# Altium project Common_Sensor_Box.PrjPCB (part 17 of 17)

## Sheet Sensor_Box_RTD2DIG.SchDoc: Title
size 420 x 297 mm; Author: G.Kasprowicz; CompanyName: WUT ISE; DrawnBy: G.Kasprowicz; Organization: WUT ISE; Address1: PW ISE; Address2: Nowowiejska 15/19 00-665 Warsaw; Address3: gkasprow@gmail.com; Revision: 1.0; SheetNumber: -; SheetTotal: -; ModifiedBy: -; CheckedDate: -; Title2: Title2; DivGrp: WUT ISE; Designer: G.Kasprowicz; ModifiedDate: -; ProjectName: Sensor Box
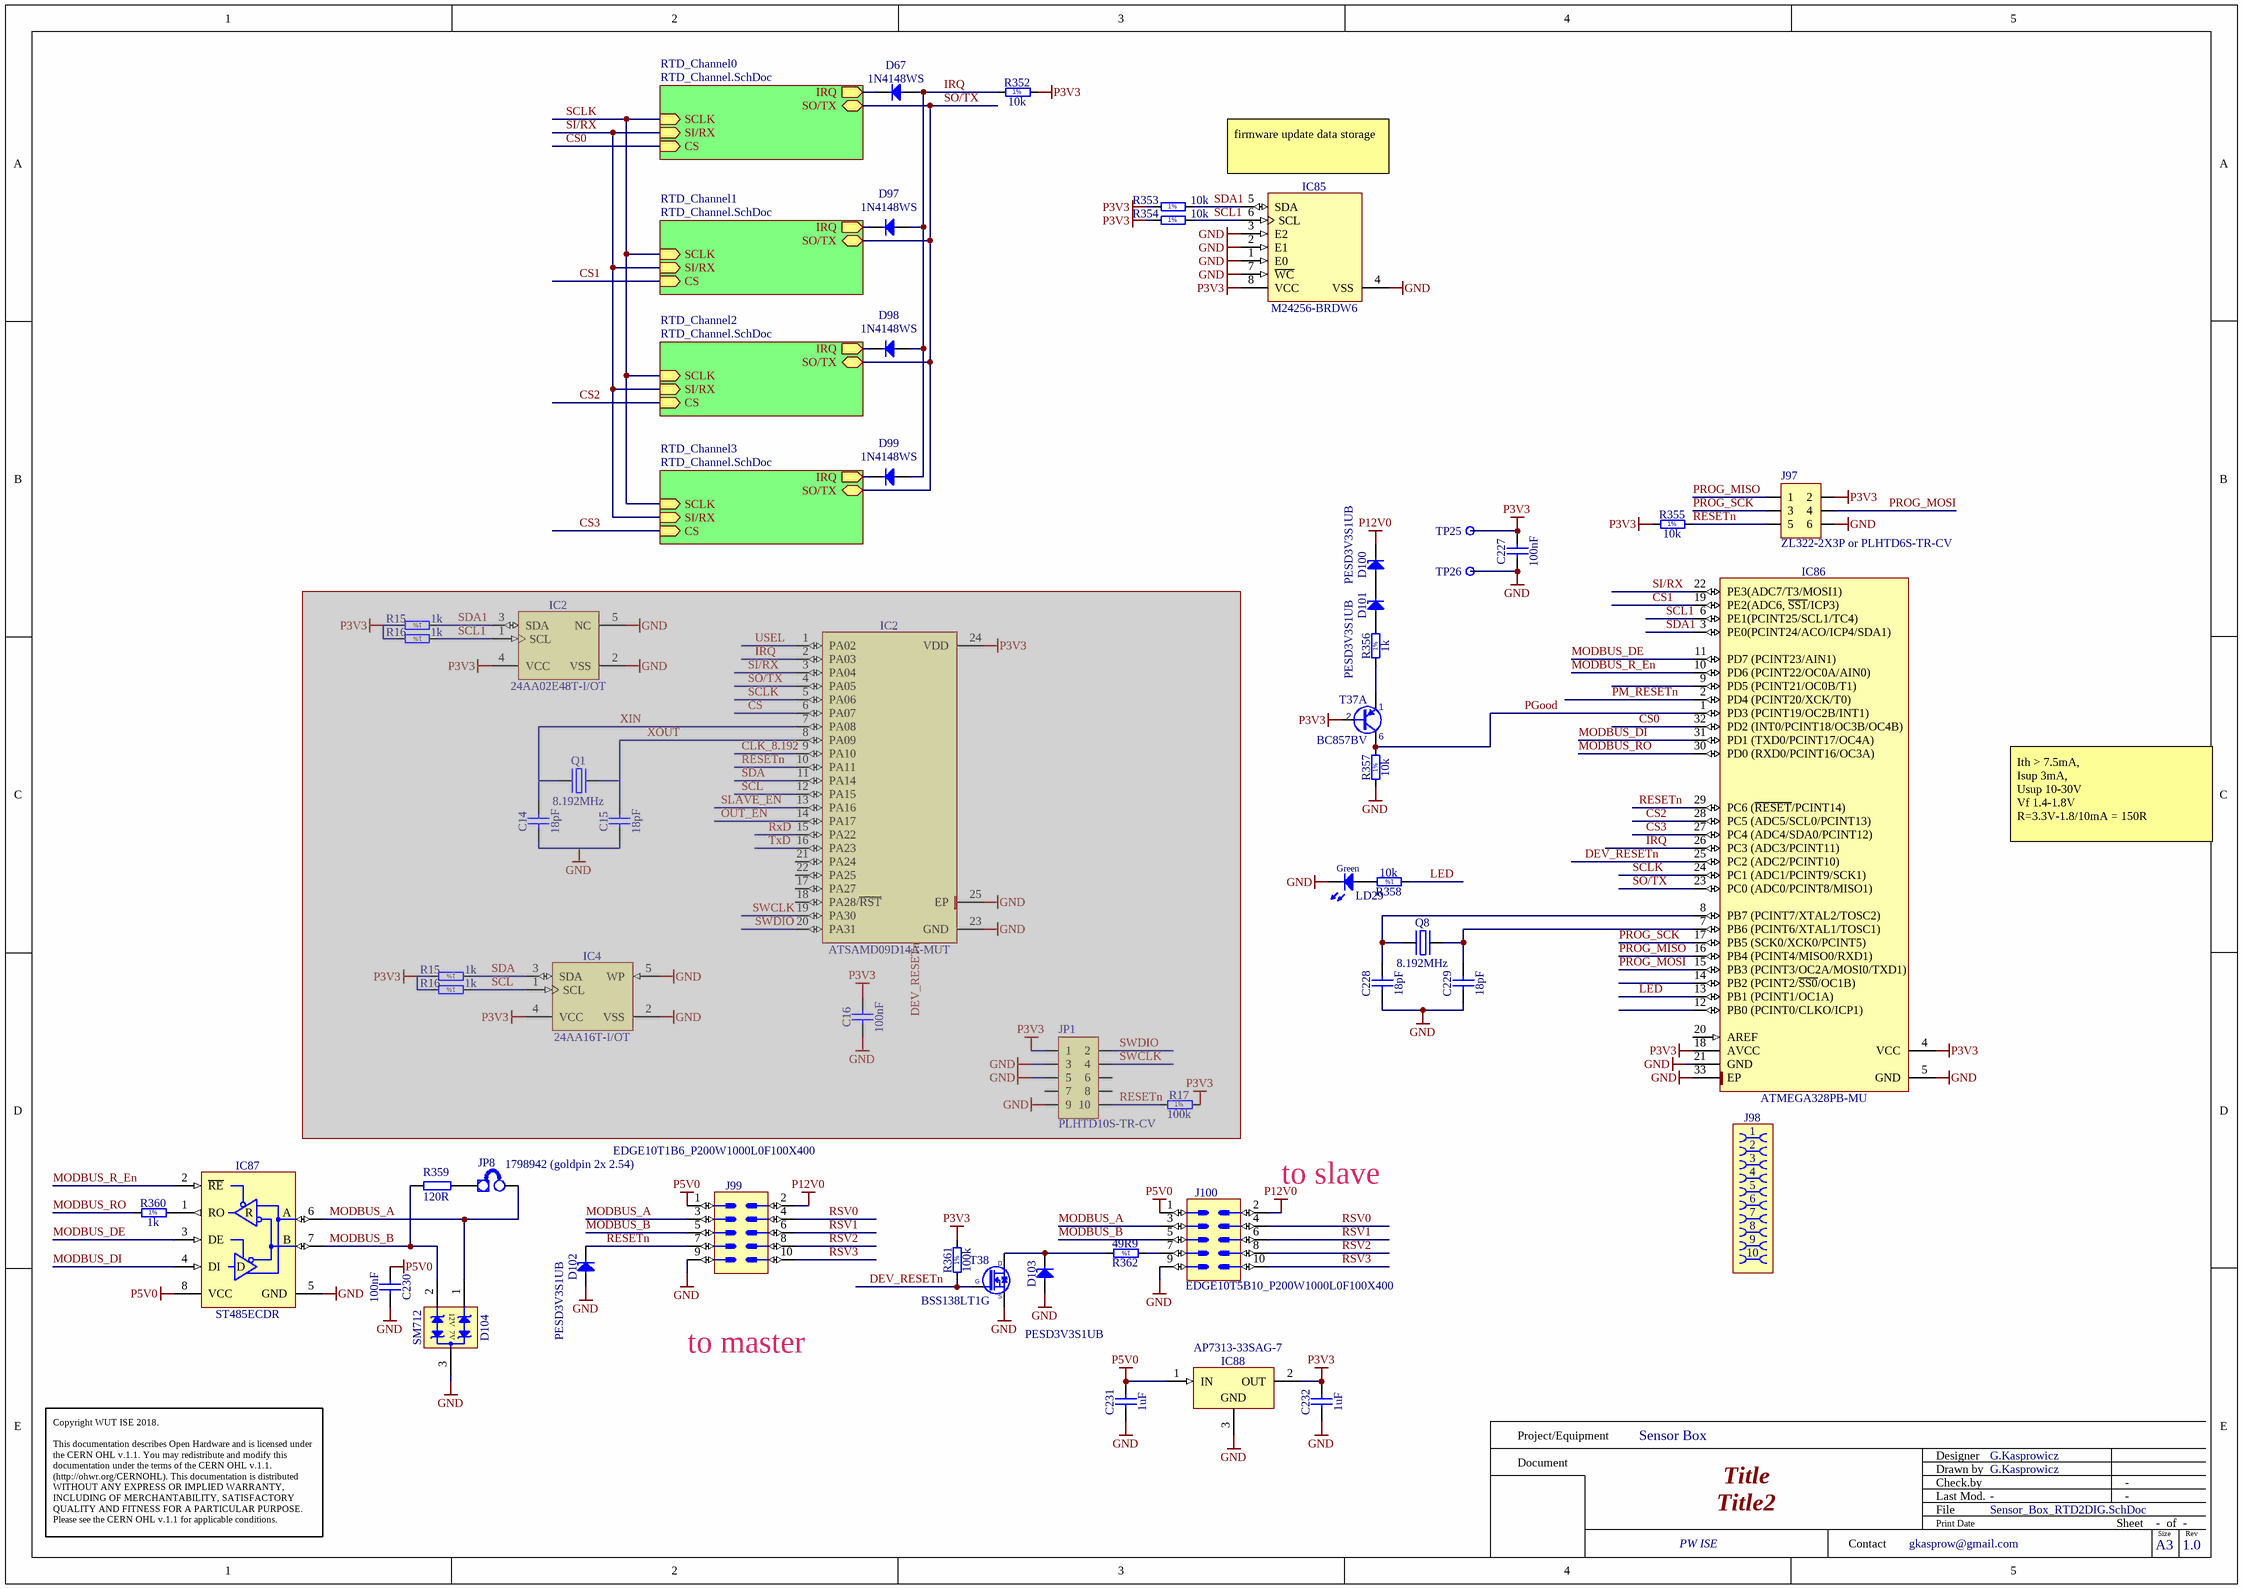
[diagram p24: Sensor_Box_RTD2DIG.SchDoc]

### Parts
(Parts that share a designator on the sheet are numbered #1, #2 ... from top to bottom, then left to right.)
C14#4  18pF  [CAPC1005X55N]  (masked out: inside a compile mask, not in the netlist)
C15#4  18pF  [CAPC1005X55N]  (masked out: inside a compile mask, not in the netlist)
C16#4  100nF  [CAPC1005X55N]  (masked out: inside a compile mask, not in the netlist)
C227  100nF  [CAPC1005X55N]
C228  18pF  [CAPC1005X55N]
C229  18pF  [CAPC1005X55N]
C230  100nF  [CAPC1005X55N]
C231  1uF  [CAPC1005X55N]
C232  1uF  [CAPC1005X55N]
D67  1N4148WS  [SODFL2512X100N]
D97  1N4148WS  [SODFL2512X100N]
D98  1N4148WS  [SODFL2512X100N]
D99  1N4148WS  [SODFL2512X100N]
D100  PESD3V3S1UB  [SODFL1608X65N]
D101  PESD3V3S1UB  [SODFL1608X65N]
D102  PESD3V3S1UB  [SODFL1608X65N]
D103  PESD3V3S1UB  [SODFL1608X65N]
D104  SM712  [SOT95P237X112-3N]
IC2#6  24AA02E48T-I/OT  [SOT95P280X145-5N]  (masked out: inside a compile mask, not in the netlist)
IC2#7  ATSAMD09D14A-MUT  [QFN50P400X400X90-25N-S275]  (masked out: inside a compile mask, not in the netlist)
IC4#4  24AA16T-I/OT  [SOT95P280X145-5N]  (masked out: inside a compile mask, not in the netlist)
IC85  M24256-BRDW6  [SOP65P640X120-8N]
IC86  ATMEGA328PB-MU  [QFN50P500X500X100-33N-S325]
IC87  ST485ECDR  [SOIC127P600X175-8N]
IC88  AP7313-33SAG-7  [SOT95P240X130-3N]
J97  ZL322-2X3P or PLHTD6S-TR-CV  [ZL322-2X3P]
J98  (no value)  [AVX_00 9159 010 061 916]
J99  (no value)  [EDGE10T1B6_P200W1000L0F100X400]
J100  (no value)  [EDGE10T5B10_P200W1000L0F100X400]
JP1#4  PLHTD10S-TR-CV  [PLHTD10S-TR-CV]  (masked out: inside a compile mask, not in the netlist)
JP8#2  1798942 (goldpin 2x 2.54)  [jump]
LD29  Green  [LED_KINGBRIGHT_KPH-1608CGCK]
Q1#4  8.192MHz  [XTAL_ABRACON_ABLS]  (masked out: inside a compile mask, not in the netlist)
Q8  8.192MHz  [XTAL_ABRACON_ABLS]
R15#6  1k  [RESC1005X40N]  (masked out: inside a compile mask, not in the netlist)
R15#7  1k  [RESC1005X40N]  (masked out: inside a compile mask, not in the netlist)
R16#6  1k  [RESC1005X40N]  (masked out: inside a compile mask, not in the netlist)
R16#7  1k  [RESC1005X40N]  (masked out: inside a compile mask, not in the netlist)
R17#4  100k  [RESC1005X40N]  (masked out: inside a compile mask, not in the netlist)
R352  10k  [RESC1005X40N]
R353  10k  [RESC1005X40N]
R354  10k  [RESC1005X40N]
R355  10k  [RESC1005X40N]
R356  1k  [RESC1005X40N]
R357  10k  [RESC1005X40N]
R358  10k  [RESC1005X40N]
R359  120R  [1206R]
R360  1k  [RESC1005X40N]
R361  100k  [RESC1005X40N]
R362  49R9  [RESC1005X40N]
T37  BC857BV  [SOTFL50P160X60-6N]  (part A of 2)
T38  BSS138LT1G  [SOT95P240X110-3N]
TP25  Test Point  [TPS127]  (value not drawn)
TP26  Test Point  [TPS127]  (value not drawn)

### Sub-sheets
RTD_Channel0 = RTD_Channel.SchDoc: IRQ (out), SCLK (in), SI/RX (in), CS (in), SO/TX (bidir)
RTD_Channel1 = RTD_Channel.SchDoc: IRQ (out), SCLK (in), SI/RX (in), CS (in), SO/TX (bidir)
RTD_Channel2 = RTD_Channel.SchDoc: IRQ (out), SCLK (in), SI/RX (in), CS (in), SO/TX (bidir)
RTD_Channel3 = RTD_Channel.SchDoc: IRQ (out), SCLK (in), SI/RX (in), CS (in), SO/TX (bidir)

### Nets
GND: C227.1 C228.1 C229.1 C230.2 C231.1 C232.1 D102.2(A) D103.2(A) D104.3(GND) IC85.1(E0) IC85.2(E1) IC85.3(E2) IC85.4(VSS) IC85.7(~{WC}) IC86.5(GND) IC86.21(GND) IC86.33(EP) IC87.5(GND) IC88.3(GND) J97.6 J99.9 J100.9 LD29.1(C) R357.1 T38.2(S) TP26.1
P3V3: C227.2 C232.2 IC85.8(VCC) IC86.4(VCC) IC86.18(AVCC) IC88.2(OUT) J97.2 R352.2 R353.1 R354.1 R355.1 R361.2 T37.2(B) TP25.1
P5V0: C230.1 C231.2 IC87.8(VCC) IC88.1(IN) J99.1 J100.1
P12V0: D100.1(C) J99.2 J100.2
CS0: IC86.32(PD2_(INT0/PCINT18/OC3B/OC4B)) ; sheet RTD_Channel0/CS
CS1: IC86.19(PE2(ADC6,_~{SS1}/ICP3)) ; sheet RTD_Channel1/CS
CS2: IC86.28(PC5_(ADC5/SCL0/PCINT13)) ; sheet RTD_Channel2/CS
CS3: IC86.27(PC4_(ADC4/SDA0/PCINT12)) ; sheet RTD_Channel3/CS
DEV_RESETn: IC86.25(PC2_(ADC2/PCINT10)) R361.1 T38.1(G)
IRQ: D67.2(A) D97.2(A) D98.2(A) D99.2(A) IC86.26(PC3_(ADC3/PCINT11)) R352.1
LED: IC86.13(PB1_(PCINT1/OC1A)) R358.1
MODBUS_A: D104.1(I/O1) IC87.6(A) J99.3 J100.3 JP8#2.2(E2)
MODBUS_B: D104.2(I/O2) IC87.7(B) J99.5 J100.5 R359.1
MODBUS_DE: IC86.11(PD7_(PCINT23/AIN1)) IC87.3(DE)
MODBUS_DI: IC86.31(PD1_(TXD0/PCINT17/OC4A)) IC87.4(DI)
MODBUS_R_En: IC86.10(PD6_(PCINT22/OC0A/AIN0)) IC87.2(~{RE})
MODBUS_RO: IC86.30(PD0_(RXD0/PCINT16/OC3A)) R360.1
PGood: IC86.1(PD3_(PCINT19/OC2B/INT1)) R357.2 T37.6(C)
PM_RESETn: IC86.2(PD4_(PCINT20/XCK/T0))
PROG_MISO: IC86.16(PB4_(PCINT4/MISO0/RXD1)) J97.1
PROG_MOSI: IC86.15(PB3_(PCINT3/OC2A/MOSI0/TXD1)) J97.4
PROG_SCK: IC86.17(PB5_(SCK0/XCK0/PCINT5)) J97.3
RESETn: D102.1(C) IC86.29(PC6_(~{RESET}/PCINT14)) J97.5 J99.7 R355.2
RSV0: J99.4 J100.4
RSV1: J99.6 J100.6
RSV2: J99.8 J100.8
RSV3: J99.10 J100.10
SCL1: IC85.6(SCL) IC86.6(PE1(PCINT25/SCL1/TC4)) R354.2
SCLK: IC86.24(PC1_(ADC1/PCINT9/SCK1)) ; sheet RTD_Channel0/SCLK, sheet RTD_Channel1/SCLK, sheet RTD_Channel2/SCLK, sheet RTD_Channel3/SCLK
SDA1: IC85.5(SDA) IC86.3(PE0(PCINT24/ACO/ICP4/SDA1)) R353.2
SI/RX: IC86.22(PE3(ADC7/T3/MOSI1)) ; sheet RTD_Channel0/SI/RX, sheet RTD_Channel1/SI/RX, sheet RTD_Channel2/SI/RX, sheet RTD_Channel3/SI/RX
SO/TX: IC86.23(PC0_(ADC0/PCINT8/MISO1)) ; sheet RTD_Channel0/SO/TX, sheet RTD_Channel1/SO/TX, sheet RTD_Channel2/SO/TX, sheet RTD_Channel3/SO/TX
NetC228_2: C228.2 IC86.8(PB7_(PCINT7/XTAL2/TOSC2)) Q8.1(OSC1)
NetC229_2: C229.2 IC86.7(PB6_(PCINT6/XTAL1/TOSC1)) Q8.2(OSC2)
NetD67_1: D67.1(C) ; sheet RTD_Channel0/IRQ
NetD97_1: D97.1(C) ; sheet RTD_Channel1/IRQ
NetD98_1: D98.1(C) ; sheet RTD_Channel2/IRQ
NetD99_1: D99.1(C) ; sheet RTD_Channel3/IRQ
NetD100_2: D100.2(A) D101.1(C)
NetD101_2: D101.2(A) R356.2
NetD103_1: D103.1(C) R362.2 T38.3(D)
NetIC87_1: IC87.1(RO) R360.2
NetJ100_7: J100.7 R362.1
NetJP8#2_1: JP8#2.1(E1) R359.2
NetLD29_2: LD29.2(A) R358.2
NetR356_1: R356.1 T37.1(E)

Not connected (* = marked no-connect by the designer): IC86 9(PD5_(PCINT21/OC0B/T1)) 12(PB0_(PCINT0/CLKO/ICP1)) 14(PB2_(PCINT2/~{SS0}/OC1B)) 20(AREF)

### Notes on the sheet
- firmware update data storage
- Ith > 7.5mA,
  Isup 3mA,
  Usup 10-30V
  Vf 1.4-1.8V
  R=3.3V-1.8/10mA = 150R
- (near J100) to slave
- to master
- Project/Equipment
- Document
- Designer
- Drawn by
- Check.by
- Copyright WUT ISE 2018.
  This documentation describes Open Hardware and is licensed under the CERN OHL v.1.1. You may redistribute and modify this documentation under the terms of the CERN OHL v.1.1. (http://ohwr.org/CERNOHL). This documentation is distributed WITHOUT ANY EXPRESS OR IMPLIED WARRANTY, INCLUDING OF MERCHANTABILITY, SATISFACTORY QUALITY AND FITNESS FOR A PARTICULAR PURPOSE. Please see the CERN OHL v.1.1 for applicable conditions.
- Contact
- File
- Last Mod.
- Print Date
- Sheet
- Size
- A3
- of
- Rev
- (in symbol R0402_1K_1%_0.0625W_100PPM) 1%
- (in symbol R0402_10K_1%_0.0625W_100PPM) 1%
- (in symbol R0402_49R9_1%_0.0625W_100PPM) 1%
- (in symbol R0402_100K_1%_0.0625W_100PPM) 1%
- (in symbol SM712) 12V; 7V
- (in symbol ST485ECDR) R; D

### Library data of the parts
C14#4 C15#4 C228 C229 = CC0402_18PF_50V_5%_C0G: as C14#3 on sheet Sensor_Box_Water_Meter_Valve; Part Number: CC0402_18PF_50V_5%_C0G; Component Kind: Standard; Component Type: Standard; Pin Count: 2; Value: 18pF; Status: Preferred; Manufacturer Part Number: CC0402_18PF_50V_5%_C0G; Case: 0402; Mounted: Yes; Socket: No; SMD: Yes; Sense: No; Manufacturer1 Example: KEMET; Manufacturer1 ComponentHeight: 0.55mm; HelpURL: \\cern.ch\dfs\Applications\Altium\Datasheets\CC0805_C0G_KEMET_(Commercial Grade).pdf; Author: CERN DEM JLC; CreateDate: 04.10.2016; LatestRevisionDate: 04.10.2016
C16#4 C227 = CC0402_100NF_16V_10%_X5R: as C16#3 on sheet Sensor_Box_Water_Meter_Valve; Part Number: CC0402_100NF_16V_10%_X5R; Component Kind: Standard; Component Type: Standard; Pin Count: 2; Value: 100nF; Status: None; Manufacturer Part Number: CC0402_100NF_16V_10%_X5R; Case: 0402; Mounted: Yes; Socket: No; SMD: Yes; Sense: No; Manufacturer1 Example: MURATA; Manufacturer1 ComponentHeight: 0.55mm; HelpURL: \\cern.ch\dfs\Applications\Altium\Datasheets\CC0402_X5R_MURATA_GRM.pdf; Author: CERN DEM JLC; CreateDate: 10.12.2013; LatestRevisionDate: 10.12.2013
C230 = CC0402_100NF_16V_10%_X7R: as C315 on sheet Sensor_Box_Water_Meter_Valve; Part Number: CC0402_100NF_16V_10%_X7R; Component Kind: Standard; Component Type: Standard; Pin Count: 2; Value: 100nF; Status: Not Recommended; Manufacturer Part Number: CC0402_100NF_16V_10%_X7R; Case: 0402; Mounted: Yes; Socket: No; SMD: Yes; Manufacturer1 Example: MURATA; Manufacturer1 ComponentHeight: 0.55mm; HelpURL: \\cern.ch\dfs\Applications\Altium\Datasheets\CC0402_X7R_MURATA_GRM.pdf; Author: CERN DEM JLC; CreateDate: 05.12.2013; LatestRevisionDate: 03.12.2007; Sense: No
C231 C232 = CC0402_1UF_16V_10%_X5R: as C308 on sheet Sensor_Box_Water_Meter_Valve; Part Number: CC0402_1UF_16V_10%_X5R; Component Kind: Standard; Component Type: Standard; Pin Count: 2; Value: 1uF; Status: Preferred; Manufacturer Part Number: CC0402_1UF_16V_10%_X5R; Case: 0402; Mounted: Yes; Socket: No; SMD: Yes; Sense: No; Manufacturer1 Example: TDK; Manufacturer1 ComponentHeight: 0.55mm; HelpURL: \\cern.ch\dfs\Applications\Altium\Datasheets\CC0402_X5R_TDK_C.pdf; Author: CERN DEM JLC; CreateDate: 25.10.2012; LatestRevisionDate: 25.10.2012
D67 D97-D99 = 1N4148WS: as D126 on sheet Sensor_Box_Water_Meter_Valve; Part Number: 1N4148WS; Component Kind: Standard; Component Type: Standard; Device: 1N4148WS; PackageDescription: SODFL Diode; 1.70mm W X 1.25mm L X 1.00mm H body, IPC Medium Density; Manufacturer Part Number: 1N4148WS; Pin Count: 2; Case: SOD-323F; Mounted: Yes; Socket: No; SMD: Yes; Sense: No; ComponentHeight: 1mm; HelpURL: \\cern.ch\dfs\Applications\Altium\Datasheets\1N4148WS.pdf; Author: CERN DEM JLC; CreateDate: 12.05.2011; LatestRevisionDate: 12.05.2011
D100-D103 = PESD3V3S1UB: as D129-D131 on sheet Sensor_Box_Water_Meter_Valve; Part Number: PESD3V3S1UB; Component Kind: Standard; Component Type: Standard; Device: PESD3V3S1UB; PackageDescription: Ultra Small Outline Diode Flat Lead (SOD-523), Body; 1.2mm L X 0.8mm W X 0.65mm H, IPC Medium Density; Manufacturer Part Number: PESD3V3S1UB; Pin Count: 2; Case: SOD523; Mounted: Yes; Socket: No; SMD: Yes; Sense: No; ComponentHeight: 0.65mm; HelpURL: \\cern.ch\dfs\Applications\Altium\Datasheets\PESD3V3S1UB.pdf; Author: CERN DEM JLC; CreateDate: 29.11.2012; LatestRevisionDate: 29.11.2012
D104 = SM712: as D132 on sheet Sensor_Box_Water_Meter_Valve; Part Number: SM712; Component Kind: Standard; Component Type: Standard; Device: SM712; PackageDescription: SOT, 0.95mm, pitch; 3 pin,1.30mm W X 2.92mm L X 1.12mm H body, IPC Medium Density; Status: Obsolete; Part Description: Asymmetrical TVS Diode for Extended Common-Mode RS-485; Manufacturer Part Number: SM712; Pin Count: 3; Case: SOT-23; Mounted: Yes; Socket: No; SMD: Yes; Sense: No; ComponentHeight: 1.12mm; HelpURL: \\cern.ch\dfs\Applications\Altium\Datasheets\SM712.pdf; Author: CERN DEM JLC; CreateDate: 23.04.2012; LatestRevisionDate: 23.04.2012
IC2#6 = 24AA02E48T-I/OT: as IC2#4 on sheet Sensor_Box_Water_Meter_Valve; Part Number: 24AA02E48T-I/OT; Component Kind: Standard; Component Type: Standard; Device: 24AA02E48T-I/OT; PackageDescription: SOT, 0.95mm pitch; 5 pin, 1.60mm W X 2.90mm L X 1.45mm H body, IPC Medium Density; Part Description: 1.7V-5.5V, 2K I2C Serial EEPROM With EUI-48 Node Identity; Manufacturer Part Number: 24AA02E48T-I/OT; Pin Count: 5; Case: SOT23-5; Mounted: Yes; Socket: No; SMD: Yes; Sense: No; ComponentHeight: 1.45mm; HelpURL: \\cern.ch\dfs\Applications\Altium\Datasheets\24AA02E48T-I-OT.pdf; Author: CERN DEM MR; CreateDate: 31.03.2016; LatestRevisionDate: 31.03.2016
IC2#7 = ATSAMD09D14A-MUT: as IC2#5 on sheet Sensor_Box_Water_Meter_Valve; Part Number: ATSAMD09D14A-MUT; Component Kind: Standard; Component Type: Standard; Device: ATSAMD09D14A-MUT; PackageDescription: QFN, 0.50mm Pitch, Square; 24 Pin, 4.00mm L X 4.00mm W X 0.90mm H Body (w/Thermal Tab 2.75 X 2.75 mm), IPC Medium Density; Part Description: 32-bit ARM®-based Cortex®-M0+ core Microcontroller, 2.4V to 3.63V, 48MHz, 16KB Flash, 4 KB SRAM, 24 QFN, Temperature Range -40°C to 85°C; Manufacturer Part Number: ATSAMD09D14A-MUT; Pin Count: 25; Case: QFN24; Mounted: Yes; Socket: No; SMD: Yes; Sense: No; ComponentHeight: 0.9mm; HelpURL: \\cern.ch\dfs\Applications\Altium\Datasheets\ATSAMD09D14A-MUT.pdf; Author: CERN DEM MR; CreateDate: 13.02.2018; LatestRevisionDate: 13.02.2018
IC4#4 = MEM_24AA16T_SOT23: as IC4#3 on sheet Sensor_Box_Water_Meter_Valve; Part Number: 24AA16T-I/OT; Component Kind: Standard; Component Type: Standard; Device: 24AA16T-I/OT; PackageDescription: SOT, 0.95mm pitch; 5 pin, 1.60mm W X 2.90mm L X 1.45mm H body, IPC Medium Density; Manufacturer Part Number: 24AA16T-I/OT; Pin Count: 5; Case: SOT23-5; Mounted: Yes; Socket: No; SMD: Yes; Sense: No; ComponentHeight: 1.45mm; HelpURL: \\cern.ch\dfs\Applications\Altium\Datasheets\24AA02E48T-I-OT.pdf; Author: GK; CreateDate: 31.03.2016; LatestRevisionDate: 31.03.2016
IC85 = MEM_M24256-BRDW6P: as IC27 on sheet Sensor_Box_Water_Meter_Valve; Part Number: M24256-BRDW6P; Component Kind: Standard; Component Type: Standard; Device: M24256-BRDW6; PackageDescription: SOP, 0.65mm pitch; 8 pin, 4.40mm W X 3.00mm L X 1.20mm H body, IPC Medium Density; Part Description: 256-Kbit Serial I²C Bus EEPROM; Manufacturer Part Number: M24256-BRDW6; Pin Count: 8; Case: TSSOP8; Mounted: Yes; Socket: No; SMD: Yes; Sense: No; ComponentHeight: 1.2mm; HelpURL: \\cern.ch\dfs\Applications\Altium\Datasheets\M24256-BRDW6P.pdf; Author: CERN DEM MR; CreateDate: 17.03.2016; LatestRevisionDate: 17.03.2016
IC86 = UPC_ATMEGA328PB-MU: as IC106 on sheet Sensor_Box_Water_Meter_Valve; Part Number: ATMEGA328PB-MU; Component Kind: Standard; Component Type: Standard; Device: ATMEGA328PB-MU; PackageDescription: QFN, (MO-220-VHHD-2) 0.50mm pitch,square; 8 pin X 8 pin, 5mm X 5mm X 1.00mm H body (w/thermal tab 3.25 X 3.25mm),  IPC Medium Density; Manufacturer Part Number: ATMEGA328PB-MU; Pin Count: 33; Case: QFN32; Mounted: Yes; Socket: No; SMD: Yes; Sense: No; ComponentHeight: 1mm; HelpURL: \\cern.ch\dfs\Applications\Altium\Datasheets\ATMEGA328P-MU.pdf; Author: GK; CreateDate: 2011-02-08; LatestRevisionDate: 2014-07-02
IC87 = ST485ECDR: as IC107 on sheet Sensor_Box_Water_Meter_Valve; Part Number: ST485ECDR; Component Kind: Standard; Component Type: Standard; Device: ST485ECDR; PackageDescription: SOIC 8, Pitch 1.27mm - Body 4x5mm, IPC Medium Density; Part Description: ±15kV ESD-Protected, Low Power  RS-485/RS-422 Transceiver; Manufacturer Part Number: ST485ECDR; Pin Count: 8; Case: SOIC8; Mounted: Yes; Socket: No; SMD: Yes; Sense: No; ComponentHeight: 1.75mm; Author: CERN DEM MR; HelpURL: \\cern.ch\dfs\Applications\Altium\Datasheets\ST485ECDR.pdf; CreateDate: 15.02.2018; LatestRevisionDate: 15.02.2018
IC88 = AP7313-33SAG-7: as IC108 on sheet Sensor_Box_Water_Meter_Valve; Part Number: AP7313-33SAG-7; Component Kind: Standard; Component Type: Standard; Device: AP7313-33SAG-7; PackageDescription: SOT23 3-Leads, Pitch 0.95mm - Body 1.3x2.9mm, IPC Medium Density; Manufacturer Part Number: AP7313-33SAG-7; Pin Count: 3; Case: SOT23; Mounted: Yes; Socket: No; SMD: Yes; Sense: No; ComponentHeight: 1.35mm; HelpURL: \\cern.ch\dfs\Applications\Altium\Datasheets\AP7313-33SAG-7.pdf; Author: CERN DEM JLC; CreateDate: 20.03.2018; LatestRevisionDate: 20.03.2018
J97 = CON_2x3 1.27 SMT Male: 1.27 mm dual row goldpin (Maritex)
J98 = AVX_00 9159 010 061 916: as J111 on sheet Sensor_Box_Water_Meter_Valve; Part Number: AVX_00 9159 010 061 916; Component Kind: Standard; Component Type: Standard; Pin Count: 10; Mounted: Yes; Socket: No; SMD: No; Sense: No; Status: None; Manufacturer Part Number: 00 9159 010 061 916; ComponentHeight: 1.6mm; HelpURL: \\cern.ch\dfs\Applications\Altium\Datasheets\AVX_00 9159 010 061 916.pdf; Author: CERN DEM MR; CreateDate: 13.02.2018; LatestRevisionDate: 13.02.2018
J99 = EDGE10T1B6_P200W1000L0F100X400: as J112 on sheet Sensor_Box_Water_Meter_Valve; Part Number: EDGE10T1B6_P200W1000L0F100X400; Component Kind: Standard (No BOM); Component Type: Standard (No BOM); Pin Count: 10; Socket: No; SMD: No; Sense: No; Status: None; ComponentHeight: 0mm; HelpURL: \\cern.ch\dfs\Applications\Altium\Datasheets\EDGE10T1B6_P200W1000L0F100X400.pdf; Author: CERN DEM MR; CreateDate: 14.02.2018; LatestRevisionDate: 14.02.2018
J100 = EDGE10T5B10_P200W1000L0F100X400: as J110 on sheet Sensor_Box_Water_Meter_Valve; Part Number: EDGE10T5B10_P200W1000L0F100X400; Component Kind: Standard (No BOM); Component Type: Standard (No BOM); Pin Count: 10; Socket: No; SMD: No; Sense: No; Status: None; ComponentHeight: 0mm; HelpURL: \\cern.ch\dfs\Applications\Altium\Datasheets\EDGE10T5B10_P200W1000L0F100X400.pdf; Author: CERN DEM MR; CreateDate: 14.02.2018; LatestRevisionDate: 14.02.2018
JP1#4 = CON_2x5 1.27 SMT Male: 1.27 mm dual row goldpin (Maritex)
JP8#2 = JUMPER: Supplier 1: Farnell; Supplier Part Number 1: 1798942
LD29 = LED_KINGBRIGHT_KPH-1608CGCK: as LD34 on sheet Sensor_Box_Water_Meter_Valve; Part Number: LED_KINGBRIGHT_KPH-1608CGCK; Component Kind: Standard; Component Type: Standard; Color: Green; PackageDescription: SMT Green LED, Case 0603, Body L 1.6 x W 0.8mm H 0.65mm; Manufacturer: KINGBRIGHT; Manufacturer Part Number: KPH-1608CGCK; Pin Count: 2; Mounted: Yes; Socket: No; SMD: Yes; Sense: No; ComponentHeight: 0.65mm; HelpURL: \\cern.ch\dfs\Applications\Altium\Datasheets\LED_KINGBRIGHT_KPH-1608CGCK.pdf; Author: CERN DEM JLC; CreateDate: 03.07.2017; LatestRevisionDate: 03.07.2017
Q1#4 Q8 = XTAL_8.192MHZ_ABRACON_ABLS-8.192MHZ-B2-T: as Q1#3 on sheet Sensor_Box_Water_Meter_Valve; Part Number: XTAL_8.192MHZ_ABRACON_ABLS-8.192MHZ-B2-T; Component Kind: Standard; Component Type: Standard; PackageDescription: SMD Crystal, Body 11.40mm L X 4.70mm W X 4.20mm H, HC/49US (AT49) ALBS Series; Value: 8.192MHz; Manufacturer: ABRACON; Manufacturer Part Number: ABLS-8.192MHZ-B2-T; Pin Count: 2; Mounted: Yes; Socket: No; SMD: Yes; Sense: No; ComponentHeight: 4.2mm; HelpURL: \\cern.ch\dfs\Applications\Altium\Datasheets\XTAL_ABRACON_ABLS.pdf; Author: CERN DEM MR; CreateDate: 15.02.2018; LatestRevisionDate: 15.02.2018
R15#6 R15#7 R16#6 R16#7 R356 R360 = R0402_1K_1%_0.0625W_100PPM: as R15#4 on sheet Sensor_Box_Water_Meter_Valve; Part Number: R0402_1K_1%_0.0625W_100PPM; Component Kind: Standard; Component Type: Standard; Pin Count: 2; Value: 1k; Status: Not Recommended; Power: 0.0625W; Tolerance: ±1%; Manufacturer Part Number: R0402_1K_1%_0.0625W_100PPM; Case: 0402; Mounted: Yes; Sense: No; Socket: No; SMD: Yes; Manufacturer1 Example: YAGEO PHYCOMP; Manufacturer1 ComponentHeight: 0.4mm; HelpURL: \\cern.ch\dfs\Applications\Altium\Datasheets\R0402_Phycomp_RC0402.pdf; Author: CERN DEM JLC; CreateDate: 03.12.2007; LatestRevisionDate: 17.10.2012
R17#4 R361 = R0402_100K_1%_0.0625W_100PPM: as R17#3 on sheet Sensor_Box_Water_Meter_Valve; Part Number: R0402_100K_1%_0.0625W_100PPM; Component Kind: Standard; Component Type: Standard; Pin Count: 2; Value: 100k; Status: Not Recommended; Power: 0.0625W; Tolerance: ±1%; Manufacturer Part Number: R0402_100K_1%_0.0625W_100PPM; Case: 0402; Mounted: Yes; Sense: No; Socket: No; SMD: Yes; Manufacturer1 Example: YAGEO PHYCOMP; Manufacturer1 ComponentHeight: 0.4mm; HelpURL: \\cern.ch\dfs\Applications\Altium\Datasheets\R0402_Phycomp_RC0402.pdf; Author: CERN DEM JLC; CreateDate: 03.12.2007; LatestRevisionDate: 17.10.2012
R352-R355 R357 R358 = R0402_10K_1%_0.0625W_100PPM: as R116 on sheet Sensor_Box_Water_Meter_Valve; Part Number: R0402_10K_1%_0.0625W_100PPM; Component Kind: Standard; Component Type: Standard; Pin Count: 2; Value: 10k; Status: Not Recommended; Power: 0.0625W; Tolerance: ±1%; Manufacturer Part Number: R0402_10K_1%_0.0625W_100PPM; Case: 0402; Mounted: Yes; Sense: No; Socket: No; SMD: Yes; Manufacturer1 Example: YAGEO PHYCOMP; Manufacturer1 ComponentHeight: 0.4mm; HelpURL: \\cern.ch\dfs\Applications\Altium\Datasheets\R0402_Phycomp_RC0402.pdf; Author: CERN DEM JLC; CreateDate: 03.12.2007; LatestRevisionDate: 17.10.2012
R359 = RES_1206: SMD Resistor; Supplier 1: Newark; Supplier Part Number 1: 39K0871
R362 = R0402_49R9_1%_0.0625W_100PPM: as R451 on sheet Sensor_Box_Water_Meter_Valve; Part Number: R0402_49R9_1%_0.0625W_100PPM; Component Kind: Standard; Component Type: Standard; Pin Count: 2; Value: 49R9; Status: Not recommended; Power: 0.0625W; Tolerance: ±1%; Manufacturer Part Number: R0402_49R9_1%_0.0625W_100PPM; Case: 0402; Mounted: Yes; Socket: No; SMD: Yes; Manufacturer1 Example: YAGEO PHYCOMP; Manufacturer1 ComponentHeight: 0.4mm; HelpURL: \\cern.ch\dfs\Applications\Altium\Datasheets\R0402_Phycomp_RC0402.pdf; Author: CERN DEM JLC; CreateDate: 2012-10-24; LatestRevisionDate: 2012-10-24
T37 = BC857BV: as T33 on sheet Sensor_Box_Water_Meter_Valve; Part Number: BC857BV; Component Kind: Standard; Component Type: Standard; Device: BC857BV; PackageDescription: SOTFL (SOT666), 0.50mm, Pitch; 6 Pin, 1.20mm W X 1.60mm L X 0.60mm H Body, IPC Medium Density; Manufacturer Part Number: BC857BV; Pin Count: 6; Case: SOT666; Mounted: Yes; Socket: No; SMD: Yes; Sense: No; ComponentHeight: 0.6mm; HelpURL: \\cern.ch\dfs\Applications\Altium\Datasheets\BC857BV.pdf; Author: CERN DEM JLC; CreateDate: 01.12.2011; LatestRevisionDate: 01.12.2011
T38 = BSS138LT1G: as T34 on sheet Sensor_Box_Water_Meter_Valve; Part Number: BSS138LT1G; Component Kind: Standard; Component Type: Standard; Device: BSS138LT1G; PackageDescription: SOT23 3-Leads, Pitch 0.95mm - Body 1.4x3mm, IPC Medium Density; Manufacturer Part Number: BSS138LT1G; Pin Count: 3; Case: SOT23-3; Mounted: Yes; Socket: No; SMD: Yes; Sense: No; ComponentHeight: 1.11mm; HelpURL: \\cern.ch\dfs\Applications\Altium\Datasheets\BSS138LT1G.pdf; Author: CERN DEM JLC; CreateDate: 23.03.2009; LatestRevisionDate: 23.03.2009
TP25 TP26 = SMD_PAD_1.27X1.27MM: as TP53-TP56 on sheet Sensor_LoRa_Flower_Watchdog; Part Number: SMD_PAD_1.27X1.27MM; Component Kind: Standard (No BOM); Component Type: Standard (No BOM); Pin Count: 1; Family: Test Point; Socket: No; SMD: Yes; Sense: No; Status: None; ComponentHeight: 0mm; HelpURL: Undefined; Author: CERN DEM JLC; CreateDate: 12.01.2008; LatestRevisionDate: 12.01.2008; PackageDescription: 1.27mm x 1.27mm PCB Copper Area (SMD Test Point)

## Sheet RTD_Channel.SchDoc: Title
size 420 x 297 mm; Author: G.Kasprowicz; CompanyName: WUT ISE; DrawnBy: G.Kasprowicz; Organization: WUT ISE; Address1: PW ISE; Address2: Nowowiejska 15/19 00-665 Warsaw; Address3: gkasprow@gmail.com; Revision: 1.0; SheetNumber: -; SheetTotal: -; ModifiedBy: -; CheckedDate: -; Title2: Title2; DivGrp: WUT ISE; Designer: G.Kasprowicz; ModifiedDate: -; ProjectName: Sensor Box
Used 4 times, as channels U_Sensor_Box_RTD2DIG/RTD_Channel0, U_Sensor_Box_RTD2DIG/RTD_Channel1, U_Sensor_Box_RTD2DIG/RTD_Channel2, U_Sensor_Box_RTD2DIG/RTD_Channel3. Parts and nets are listed once, with the designators drawn on the sheet.
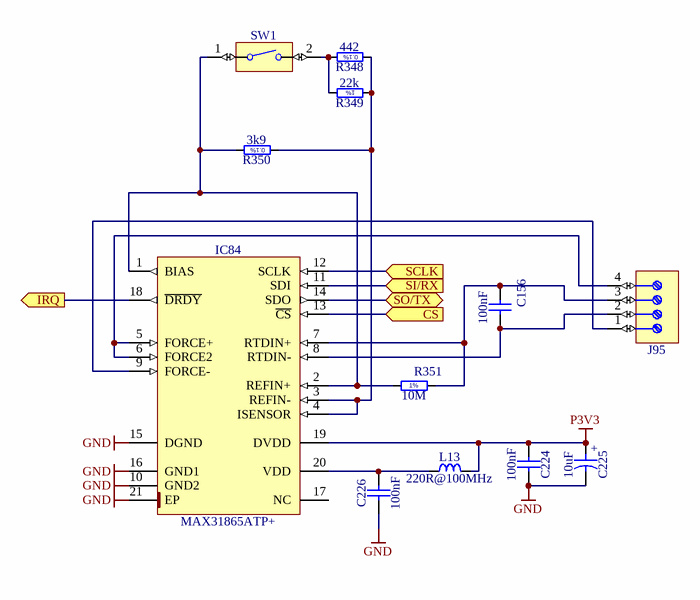
[diagram p25: RTD_Channel.SchDoc]

### Parts
C156  100nF  [CAPC1005X55N]
C224  100nF  [CAPC1005X55N]
C225  10uF  [CAPMP3216X180N]
C226  100nF  [CAPC1005X55N]
IC84  MAX31865ATP+  [QFN65P500X500X80-21N-S335]
J95  (no value)  [PHOENIX_1725672]
L13  220R@100MHz  [INDC1005X55N]
R348  442  [RESC1608X55N]
R349  22k  [RESC1005X40N]
R350  3k9  [RESC1608X55N]
R351  10M  [RESC1608X55N]
SW1  Switch  [SW_OMRON_A6SN-1101]  (value not drawn)

### Ports
CS (in), IRQ (out), SCLK (in), SI/RX (in), SO/TX (bidir)

### Nets
GND: C224.2 C225.2 C226.1 IC84.10(GND2) IC84.15(DGND) IC84.16(GND1) IC84.21(EP)
P3V3: C224.1 C225.1 IC84.19(DVDD) L13.2
CS: IC84.13(~{CS}) ; port CS
IRQ: IC84.18(~{DRDY}) ; port IRQ
SCLK: IC84.12(SCLK) ; port SCLK
SI/RX: IC84.11(SDI) ; port SI/RX
SO/TX: IC84.14(SDO) ; port SO/TX
NetC156_1: C156.1 IC84.7(RTDIN+) J95.3 R351.2
NetC156_2: C156.2 IC84.8(RTDIN-) J95.2
NetC226_2: C226.2 IC84.20(VDD) L13.1
NetIC84_1: IC84.1(BIAS) IC84.2(REFIN+) R350.2 R351.1 SW1.1
NetIC84_3: IC84.3(REFIN-) IC84.4(ISENSOR) R348.1 R349.1 R350.1
NetIC84_5: IC84.5(FORCE+) IC84.6(FORCE2) J95.4
NetIC84_9: IC84.9(FORCE-) J95.1
NetR348_2: R348.2 R349.2 SW1.2

Not connected (* = marked no-connect by the designer): IC84 17(NC)

### Channels
U_Sensor_Box_RTD2DIG/RTD_Channel0: designators end in _RTD_Channel0; ports CS=NetIC84_RTD_Channel0_13 IRQ=NetIC84_RTD_Channel0_18 SCLK=NetIC84_RTD_Channel0_12 SI/RX=NetIC84_RTD_Channel0_11 SO/TX=NetIC84_RTD_Channel0_14
U_Sensor_Box_RTD2DIG/RTD_Channel1: designators end in _RTD_Channel1; ports CS=NetIC84_RTD_Channel0_13 IRQ=NetIC84_RTD_Channel0_18 SCLK=NetIC84_RTD_Channel0_12 SI/RX=NetIC84_RTD_Channel0_11 SO/TX=NetIC84_RTD_Channel0_14
U_Sensor_Box_RTD2DIG/RTD_Channel2: designators end in _RTD_Channel2; ports CS=NetIC84_RTD_Channel0_13 IRQ=NetIC84_RTD_Channel0_18 SCLK=NetIC84_RTD_Channel0_12 SI/RX=NetIC84_RTD_Channel0_11 SO/TX=NetIC84_RTD_Channel0_14
U_Sensor_Box_RTD2DIG/RTD_Channel3: designators end in _RTD_Channel3; ports CS=NetIC84_RTD_Channel0_13 IRQ=NetIC84_RTD_Channel0_18 SCLK=NetIC84_RTD_Channel0_12 SI/RX=NetIC84_RTD_Channel0_11 SO/TX=NetIC84_RTD_Channel0_14

### Notes on the sheet
- Project/Equipment
- Document
- Designer
- Drawn by
- Check.by
- Copyright WUT ISE 2018.
  This documentation describes Open Hardware and is licensed under the CERN OHL v.1.1. You may redistribute and modify this documentation under the terms of the CERN OHL v.1.1. (http://ohwr.org/CERNOHL). This documentation is distributed WITHOUT ANY EXPRESS OR IMPLIED WARRANTY, INCLUDING OF MERCHANTABILITY, SATISFACTORY QUALITY AND FITNESS FOR A PARTICULAR PURPOSE. Please see the CERN OHL v.1.1 for applicable conditions.
- Contact
- File
- Last Mod.
- Print Date
- Sheet
- Size
- A3
- of
- Rev
- (in symbol CTE3216-18_10UF_16V_20%_AVX_TCJ) +
- (in symbol R0402_22K_1%_0.0625W_100PPM) 1%
- (in symbol R0603_10M_1%_0.1W_100PPM) 1%
- (in symbol RES_0603_3k9_0.1%_10ppm) 0.1%
- (in symbol RES_0603_442R_0.1%_25ppm) 0.1%

### Library data of the parts
C156 C224 C226 = CC0402_100NF_16V_10%_X5R: as C16#3 on sheet Sensor_Box_Water_Meter_Valve; Part Number: CC0402_100NF_16V_10%_X5R; Component Kind: Standard; Component Type: Standard; Pin Count: 2; Value: 100nF; Status: None; Manufacturer Part Number: CC0402_100NF_16V_10%_X5R; Case: 0402; Mounted: Yes; Socket: No; SMD: Yes; Sense: No; Manufacturer1 Example: MURATA; Manufacturer1 ComponentHeight: 0.55mm; HelpURL: \\cern.ch\dfs\Applications\Altium\Datasheets\CC0402_X5R_MURATA_GRM.pdf; Author: CERN DEM JLC; CreateDate: 10.12.2013; LatestRevisionDate: 10.12.2013
C225 = CTE3216-18_10UF_16V_20%_AVX_TCJ: Polarised capacitor; Part Description: ESR 0R200 Tantalum Solid Electrolytic Chip Capacitor with Conductive Polymer Electrode; Manufacturer: AVX; Manufacturer Part Number: TCJA106M016R0200; Voltage: 16V; Tolerance: ±20%; Part Number: CTE3216-18_10UF_16V_20%_AVX_TCJ; Component Kind: Standard; Component Type: Standard; Pin Count: 2; Value: 10uF; Status: Preferred; Case: A; Mounted: Yes; Socket: No; SMD: Yes; Sense: No; ComponentHeight: 1.8mm; HelpURL: \\cern.ch\dfs\Applications\Altium\Datasheets\CTE_AVX_TCJ.pdf; Author: CERN DEM JLC; CreateDate: 29.03.2012; LatestRevisionDate: 29.03.2012
IC84 = MAX31865ATP+: RTD-to-Digital Converter; Manufacturer: MAXIM; PressFit: No; Bonding: No; Part Number: MAX31865ATP+; Component Kind: Standard; Component Type: Standard; Device: MAX31865ATP+; PackageDescription: QFN, 0.65mm pitch, Square; 20 pin, 5.00mm L X 5.00mm W X 0.80mm H Body (W/Thermal Tab 3.35mm X 3.35mm), IPC Medium Density; Part Description: RTD-to-Digital Converter; Manufacturer Part Number: MAX31865ATP+; Pin Count: 21; Case: QFN20; Mounted: Yes; Socket: No; SMD: Yes; Sense: No; ComponentHeight: 0.8mm; Author: CERN DEM MR; HelpURL: \\cern.ch\dfs\Applications\Altium\Datasheets\MAX31865ATP+.pdf; CreateDate: 09.06.2016; LatestRevisionDate: 09.06.2016
J95 = PHOENIX_1725672: Terminal Block, 4 Positions, Screw Connection; Part Description: 6A, 63V, Terminal Block, Pitch 2.54mm, 4 Positions, Screw Connection; Manufacturer: PHOENIX CONTACT; Manufacturer Part Number: 1725672 (MPT 0,5/4-2,54); PressFit: No; Part Number: PHOENIX_1725672; Component Kind: Standard; Component Type: Standard; Pin Count: 4; Mounted: Yes; Socket: No; SMD: No; Sense: No; Status: None; ComponentHeight: 8.5mm; HelpURL: \\cern.ch\dfs\Applications\Altium\Datasheets\PHOENIX_1725672.pdf; Author: CERN DEM JMW; CreateDate: 07.11.2008; LatestRevisionDate: 26.04.2010
L13 = IND0402_MURATA_BLM15HB221SN1: Inductor; Part Description: SMD EMIFIL Suppression Chip Ferrite Bead; Manufacturer: MURATA; Power: 250mA; Resistance: 1R; Tolerance: ±25%; Part Number: IND0402_MURATA_BLM15HB221SN1; Component Kind: Standard; Component Type: Standard; Pin Count: 2; Value: 220R@100MHz; Status: None; Manufacturer Part Number: BLM15HB221SN1; Case: 0402; Mounted: Yes; Socket: No; SMD: Yes; Sense: No; ComponentHeight: 0.55mm; HelpURL: \\cern.ch\dfs\Applications\Altium\Datasheets\IND0402_MURATA_BLM15H.pdf; Author: CERN DEM JLC; CreateDate: 23.06.2009; LatestRevisionDate: 23.06.2009
R348 = RES_0603_442R_0.1%_25ppm: Resistor - 0.1%; Part Number: R0603_442R_0.1%_0.063W_25PPM; Part Description: Thin Film Chip Resistor; Manufacturer: GENERIC; Manufacturer1 Part Number: RP73PF1J442RBTDF; Power: 0.063W; TC: ±25ppm; PressFit: No; Component Kind: Standard; Component Type: Standard; Pin Count: 2; Value: 442; Status: Not Recommended; Tolerance: ±0.1%; Manufacturer Part Number: R0603_442R_0.1%_0.063W_25PPM; Case: 0603; Mounted: Yes; Sense: No; Socket: No; SMD: Yes; Manufacturer1 Example: TYCO HOLSWORTHY; Manufacturer1 ComponentHeight: 0.5mm; HelpURL: \\cern.ch\dfs\Applications\Altium\Datasheets\R0603_Tyco_RN73.pdf; Author: GK; CreateDate: 03.12.2007; LatestRevisionDate: 13.03.2008
R349 = R0402_22K_1%_0.0625W_100PPM: Resistor - 1%; Part Description: General Purpose Thick Film Chip Resistor; Manufacturer: GENERIC; Manufacturer1 Part Number: 232270672203L; TC: ±100ppm/°C; PressFit: No; Part Number: R0402_22K_1%_0.0625W_100PPM; Component Kind: Standard; Component Type: Standard; Pin Count: 2; Value: 22k; Status: Not Recommended; Power: 0.0625W; Tolerance: ±1%; Manufacturer Part Number: R0402_22K_1%_0.0625W_100PPM; Case: 0402; Mounted: Yes; Sense: No; Socket: No; SMD: Yes; Manufacturer1 Example: YAGEO PHYCOMP; Manufacturer1 ComponentHeight: 0.4mm; HelpURL: \\cern.ch\dfs\Applications\Altium\Datasheets\R0402_Phycomp_RC0402.pdf; Author: CERN DEM JLC; CreateDate: 03.12.2007; LatestRevisionDate: 17.10.2012
R350 = RES_0603_3k9_0.1%_10ppm: Resistor - 0.1%; Part Number: R0603_3k9_0.1%_0.063W_10PPM; Part Description: Thin Film Chip Resistor; Manufacturer: GENERIC; Manufacturer1 Part Number: ERA3ARB392V; Power: 0.063W; TC: ±10ppm; PressFit: No; Component Kind: Standard; Component Type: Standard; Pin Count: 2; Value: 3k9; Status: Not Recommended; Tolerance: ±0.1%; Manufacturer Part Number: R0603_3k9_0.1%_0.063W_10PPM; Case: 0603; Mounted: Yes; Sense: No; Socket: No; SMD: Yes; Manufacturer1 Example: Panasonic; Manufacturer1 ComponentHeight: 0.5mm; HelpURL: \\cern.ch\dfs\Applications\Altium\Datasheets\R0603_Tyco_RN73.pdf; Author: GK; CreateDate: 03.12.2007; LatestRevisionDate: 13.03.2008
R351 = R0603_10M_1%_0.1W_100PPM: Resistor - 1%; Part Description: General Purpose Thick Film Chip Resistor; Manufacturer: GENERIC; Manufacturer1 Part Number: CRCW060310M0FKEA; Power: 0.1W; TC: ±100ppm/°C; PressFit: No; Part Number: R0603_10M_1%_0.1W_100PPM; Component Kind: Standard; Component Type: Standard; Pin Count: 2; Value: 10M; Status: Preferred; Tolerance: ±1%; Manufacturer Part Number: R0603_10M_1%_0.1W_100PPM; Case: 0603; Mounted: Yes; Sense: No; Socket: No; SMD: Yes; Manufacturer1 Example: VISHAY; Manufacturer1 ComponentHeight: 0.55mm; HelpURL: \\cern.ch\dfs\Applications\Altium\Datasheets\R0603_VISHAY_CRCW e3.pdf; Author: CERN DEM JLC; CreateDate: 12.01.2017; LatestRevisionDate: 12.01.2017
SW1 = SW_OMRON_A6SN-1101: 1 Ways SPST DIP Switch; Part Description: 1 Way SPST Surface-Mounting Slide Switch With Flat Actuator, Contact Rating 25mA 24VDC; Manufacturer: OMRON; PressFit: No; Part Number: SW_OMRON_A6SN-1101; Component Kind: Standard; Component Type: Standard; Pin Count: 2; PackageDescription: Body 4.48x7.5mm, 1 Way SPST Surface-Mounting Slide Switch With Flat Actuator (A6SN Series); Family: Switch; Mounted: Yes; Socket: No; SMD: Yes; Sense: No; Status: None; Manufacturer Part Number: A6SN-1101; ComponentHeight: 4.6mm; HelpURL: \\cern.ch\dfs\Applications\Altium\Datasheets\SW_OMRON_A6SN-1101.pdf; Author: CERN DEM JLC; CreateDate: 25.02.2013; LatestRevisionDate: 25.02.2013

## Nets that join several sheets
GND: Power_meter (27 pins), Sensorbox_Hub_ESP32 (51 pins), Sensor_Box_Ethernet (30 pins), Sensor_Box_GPRS (36 pins), Sensor_Box_Hub_SAMD21 (60 pins), W5500 (23 pins), Sensor_Box_PoE (15 pins), Sensor_Box_PWR_AC (11 pins), Sensor_Box_PWR_DC (13 pins), Sensor_Box_IO_Relay (41 pins), U_Sensor_Box_Simple_IO (10 pins), U_Sensor_Box_Simple_IO (10 pins), Sensor_Box_Smart_IO (57 pins), Sensor_Box_Hub_OrangePi (56 pins), Sensor_Box_PWR_Backup (43 pins), Sensor_Box_CAN_Switch (44 pins), Sensor_Box_CAN_SENS (57 pins), Sensor_Box_CAN_Shutter_CTRL (43 pins), Sensor_Box_RGB_CTRL (29 pins), Sensor_Box_CAN_Shutter_CTRL_STM (48 pins), Sensor_Box_CAN_Switch_STM (48 pins), Sensor_Box_Water_Meter_Valve (38 pins), Sensor_LoRa_Flower_Watchdog (40 pins), Sensor_Box_LoRa (38 pins), Sensor_Box_RTD2DIG (26 pins), U_Sensor_Box_RTD2DIG/RTD_Channel0 (7 pins), U_Sensor_Box_RTD2DIG/RTD_Channel1 (7 pins), U_Sensor_Box_RTD2DIG/RTD_Channel2 (7 pins), U_Sensor_Box_RTD2DIG/RTD_Channel3 (7 pins)
P3V3: Power_meter (13 pins), Sensorbox_Hub_ESP32 (20 pins), Sensor_Box_Ethernet (15 pins), Sensor_Box_GPRS (J18.2 J19.2), Sensor_Box_Hub_SAMD21 (33 pins), W5500 (9 pins), Sensor_Box_IO_Relay (12 pins), U_Sensor_Box_Simple_IO (6 pins), U_Sensor_Box_Simple_IO (6 pins), Sensor_Box_Smart_IO (23 pins), Sensor_Box_Hub_OrangePi (27 pins), Sensor_Box_PWR_Backup (9 pins), Sensor_Box_CAN_SENS (29 pins), Sensor_Box_RGB_CTRL (12 pins), Sensor_Box_CAN_Shutter_CTRL_STM (17 pins), Sensor_Box_CAN_Switch_STM (16 pins), Sensor_Box_Water_Meter_Valve (10 pins), Sensor_Box_LoRa (18 pins), Sensor_Box_RTD2DIG (14 pins), U_Sensor_Box_RTD2DIG/RTD_Channel0 (C224_RTD_Channel0.1 C225_RTD_Channel0.1 IC84_RTD_Channel0.19 L13_RTD_Channel0.2), U_Sensor_Box_RTD2DIG/RTD_Channel1 (C224_RTD_Channel1.1 C225_RTD_Channel1.1 IC84_RTD_Channel1.19 L13_RTD_Channel1.2), U_Sensor_Box_RTD2DIG/RTD_Channel2 (C224_RTD_Channel2.1 C225_RTD_Channel2.1 IC84_RTD_Channel2.19 L13_RTD_Channel2.2), U_Sensor_Box_RTD2DIG/RTD_Channel3 (C224_RTD_Channel3.1 C225_RTD_Channel3.1 IC84_RTD_Channel3.19 L13_RTD_Channel3.2)
P5V0: Power_meter (6 pins), Sensorbox_Hub_ESP32 (19 pins), Sensor_Box_Ethernet (J7.1 J8.1), Sensor_Box_GPRS (5 pins), Sensor_Box_Hub_SAMD21 (13 pins), Sensor_Box_PoE (6 pins), Sensor_Box_PWR_AC (7 pins), Sensor_Box_PWR_DC (6 pins), Sensor_Box_IO_Relay (12 pins), U_Sensor_Box_Simple_IO (J71_U_Sensor_Box_Simple_IO#1.1), U_Sensor_Box_Simple_IO (J71_U_Sensor_Box_Simple_IO#2.1), Sensor_Box_Smart_IO (6 pins), Sensor_Box_Hub_OrangePi (16 pins), Sensor_Box_CAN_Switch (23 pins), Sensor_Box_CAN_SENS (12 pins), Sensor_Box_CAN_Shutter_CTRL (25 pins), Sensor_Box_RGB_CTRL (6 pins), Sensor_Box_CAN_Shutter_CTRL_STM (15 pins), Sensor_Box_CAN_Switch_STM (13 pins), Sensor_Box_Water_Meter_Valve (12 pins), Sensor_Box_LoRa (6 pins), Sensor_Box_RTD2DIG (6 pins)
P12V0: Power_meter (D107.1 J4.2 J5.2), Sensorbox_Hub_ESP32 (J43.2 J45.2 J47.1), Sensor_Box_Ethernet (J7.2 J8.2), Sensor_Box_GPRS (J15.2 J16.2), Sensor_Box_Hub_SAMD21 (J23.1 J26.2 J27.2), Sensor_Box_PWR_AC (7 pins), Sensor_Box_PWR_DC (8 pins), Sensor_Box_IO_Relay (D43.2 J63.2 J64.2), U_Sensor_Box_Simple_IO (D52_U_Sensor_Box_Simple_IO#1.2 J71_U_Sensor_Box_Simple_IO#1.2), U_Sensor_Box_Simple_IO (D52_U_Sensor_Box_Simple_IO#2.2 J71_U_Sensor_Box_Simple_IO#2.2), Sensor_Box_Smart_IO (6 pins), Sensor_Box_Hub_OrangePi (J53.1 J56.2 J57.2), Sensor_Box_PWR_Backup (J66.2 J67.2 R208.2 R214.2), Sensor_Box_CAN_Switch (D63.1 D72.2 J1.1), Sensor_Box_CAN_SENS (D29.2 D62.1 J48.1), Sensor_Box_CAN_Shutter_CTRL (D32.2 D64.1 J50.1), Sensor_Box_RGB_CTRL (J88.2 J89.2), Sensor_Box_CAN_Shutter_CTRL_STM (D109.2 D110.1 J103.1), Sensor_Box_CAN_Switch_STM (D119.2 D120.1 J105.1), Sensor_Box_Water_Meter_Valve (D129.1 J110.2 J112.2), Sensor_Box_LoRa (J118.2 J120.2), Sensor_Box_RTD2DIG (D100.1 J99.2 J100.2)
NetIC84_RTD_Channel0_11: U_Sensor_Box_RTD2DIG/RTD_Channel0 (IC84_RTD_Channel0.11), U_Sensor_Box_RTD2DIG/RTD_Channel1 (IC84_RTD_Channel1.11), U_Sensor_Box_RTD2DIG/RTD_Channel2 (IC84_RTD_Channel2.11), U_Sensor_Box_RTD2DIG/RTD_Channel3 (IC84_RTD_Channel3.11)
NetIC84_RTD_Channel0_12: U_Sensor_Box_RTD2DIG/RTD_Channel0 (IC84_RTD_Channel0.12), U_Sensor_Box_RTD2DIG/RTD_Channel1 (IC84_RTD_Channel1.12), U_Sensor_Box_RTD2DIG/RTD_Channel2 (IC84_RTD_Channel2.12), U_Sensor_Box_RTD2DIG/RTD_Channel3 (IC84_RTD_Channel3.12)
NetIC84_RTD_Channel0_13: U_Sensor_Box_RTD2DIG/RTD_Channel0 (IC84_RTD_Channel0.13), U_Sensor_Box_RTD2DIG/RTD_Channel1 (IC84_RTD_Channel1.13), U_Sensor_Box_RTD2DIG/RTD_Channel2 (IC84_RTD_Channel2.13), U_Sensor_Box_RTD2DIG/RTD_Channel3 (IC84_RTD_Channel3.13)
NetIC84_RTD_Channel0_14: U_Sensor_Box_RTD2DIG/RTD_Channel0 (IC84_RTD_Channel0.14), U_Sensor_Box_RTD2DIG/RTD_Channel1 (IC84_RTD_Channel1.14), U_Sensor_Box_RTD2DIG/RTD_Channel2 (IC84_RTD_Channel2.14), U_Sensor_Box_RTD2DIG/RTD_Channel3 (IC84_RTD_Channel3.14)
NetIC84_RTD_Channel0_18: U_Sensor_Box_RTD2DIG/RTD_Channel0 (IC84_RTD_Channel0.18), U_Sensor_Box_RTD2DIG/RTD_Channel1 (IC84_RTD_Channel1.18), U_Sensor_Box_RTD2DIG/RTD_Channel2 (IC84_RTD_Channel2.18), U_Sensor_Box_RTD2DIG/RTD_Channel3 (IC84_RTD_Channel3.18)